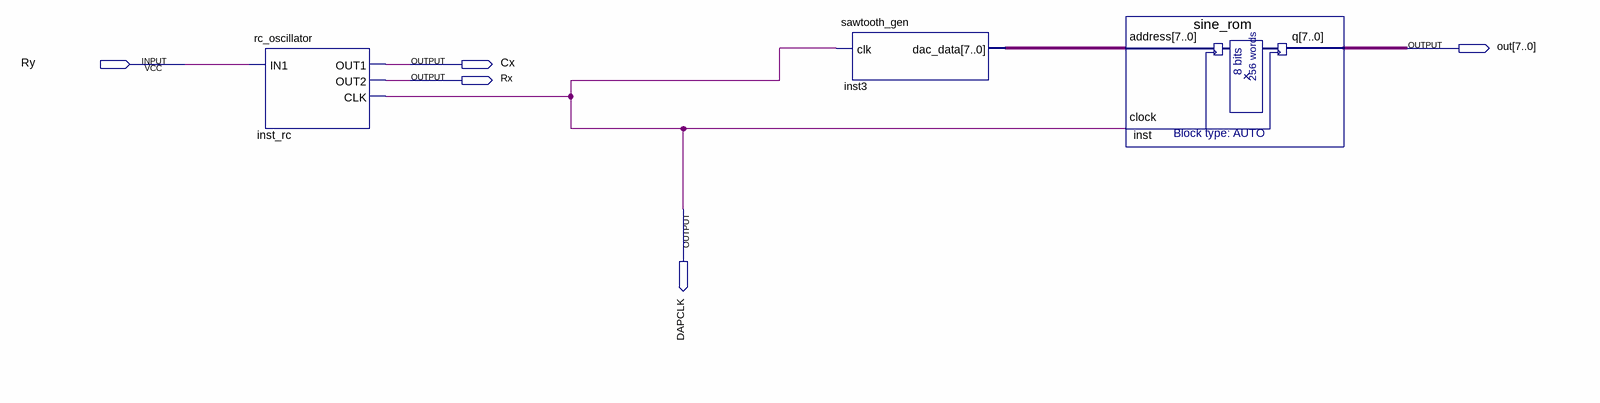
[diagram p0: schematic sheet]
// Quartus schematic sinGen.bdf as structural Verilog: 3 symbols, 5 pins
module sinGen (
  input  Ry,
  output [7:0] out,
  output Cx,
  output Rx,
  output DAPCLK
);

  wire [7:0] inst3_dac_data;

  rc_oscillator inst_rc (.IN1(Ry), .OUT1(Cx), .OUT2(Rx), .CLK(DAPCLK));
  sawtooth_gen inst3 (.clk(DAPCLK), .dac_data(inst3_dac_data));
  sine_rom inst (.address(inst3_dac_data), .clock(DAPCLK), .q(out));
endmodule
